# EAGLE design AC_light (EAGLE 8.5.1)
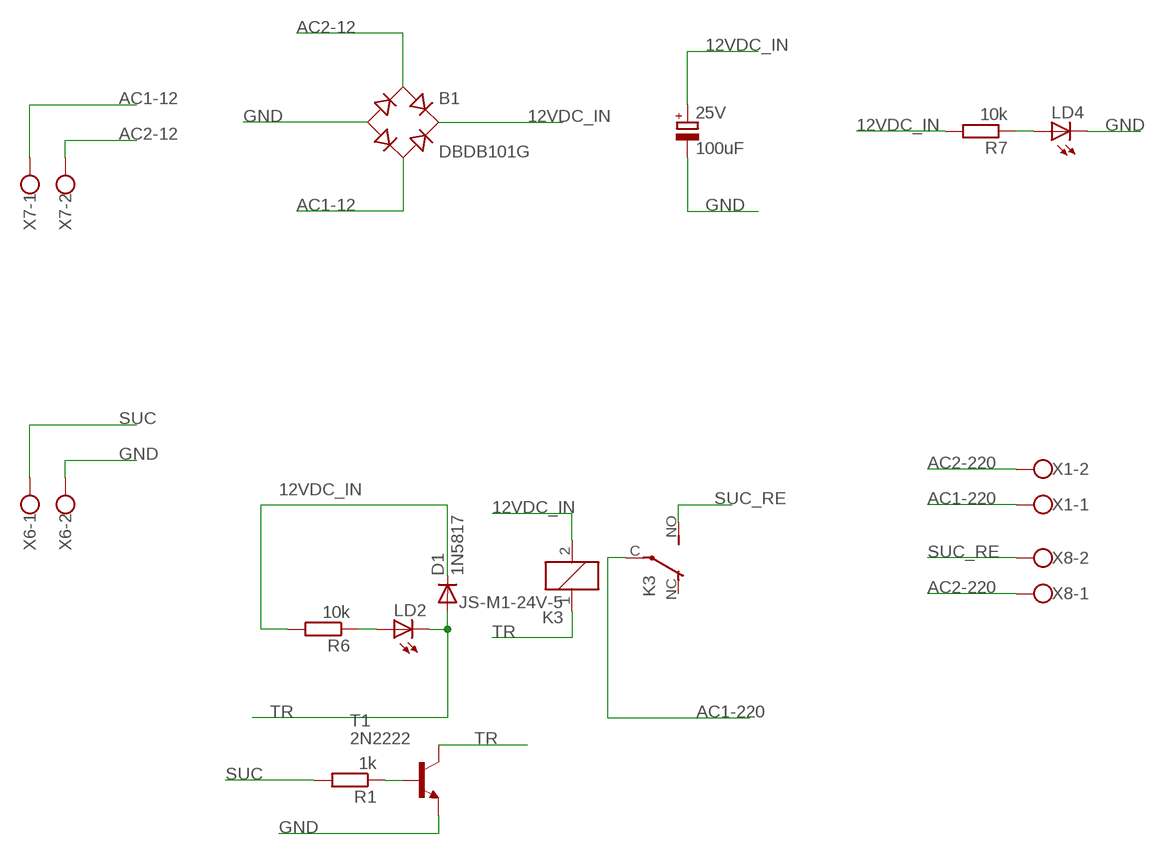
[diagram p0: schematic, sheet 1]

## Parts
25V  100uF  CPOL-EUE3.5-8  [E3,5-8]
B1  DBDB101G  [DB]
D1  1N5817  1N4004  [DO41-10]
K3  JS-M1-24V-5  JS-M1-12V-5  [JS-M]
LD2  LED5MM  [LED5MM]
LD4  LED5MM  [LED5MM]
R1  1k  R-EU_0207/10  [0207/10]
R6  10k  R-EU_0207/10  [0207/10]
R7  10k  R-EU_0207/10  [0207/10]
T1  2N2222  [TO92-EBC-OVAL]
X1  W237-102  [W237-102]
X6  W237-102  [W237-102]
X7  W237-102  [W237-102]
X8  W237-102  [W237-102]

## Nets
12VDC_IN: 25V.+ B1.+ D1.C K3.2 R6.2 R7.2
AC1-12: B1.AC2 X7.1
AC1-220: K3.C(2:P) X1.1
AC2-12: B1.AC1 X7.2
AC2-220: X1.2 X8.1
GND: 25V.- B1.- LD4.K(C) T1.E X6.2
N$3: R1.1 T1.B
N$8: LD4.A R7.1
N$9: LD2.A R6.1
SUC: R1.2 X6.1
SUC_RE: K3.NO(2:S) X8.2
TR: D1.A K3.1 LD2.K(C) T1.C
Unconnected: K3.NC(2:O)

## Library data of the parts
25V = rcl:CPOL-EU: POLARIZED CAPACITOR, European symbol; SPICEPREFIX: C
B1 = rectifier:DB?*G: Single Phase 1.0 AMP Glass Passivated Bridge Rectifier Taiwan Semiconductor Co.,Ltd. - TSC Source: http://www.taiwansemi.com/TSCbig5/ezcatfiles/cust/img/img/db101g.pdf http://www.ts.com.tw/db/pictures/modules/PDT/PDT060207001/DBLS201G.pdf
D1 = adafruit:1N4004: DIODE General purpose 1N400x type rectifier (With bigger pads) http://www.ladyada.net/library/pcb/eaglelibrary.html
K3 = relay:JS-M1*: Automotive Ultra-Miniature Power Relay NAiS Source: http://www.mew-europe.com/.. en_ds_61211_0000.pdf; MF: FARNELL; MPN: JSM1-12V-5; OC_FARNELL: 910351; OC_NEWARK: 14J1764
LD2 LD4 = led:LED: LED OSRAM: - CHIPLED LG R971, LG N971, LY N971, LG Q971, LY Q971, LO R971, LY R971 LH N974, LH R974 LS Q976, LO Q976, LY Q976 LO Q996 - Hyper CHIPLED LW Q18S LB Q993, LB Q99A, LB R99A - SideLED LS A670, LO A670, LY A670, LG A670, LP A670 LB A673, LV A673, LT A673, LW A673 LH A674 LY A675 LS A676, LA A676, LO A676, LY A676, LW A676 LS A679, LY A679, LG A679 - Hyper Micro SIDELED® LS Y876, LA Y876, LO Y876, LY Y876 LT Y87S - SmartLED LW L88C, LW L88S LB L89C, LB L89S, LG L890 LS L89K, LO L89K, LY L89K LS L896, LA L896, LO L896, LY L896 - TOPLED LS T670, LO T670, LY T670, LG T670, LP T670 LSG T670, LSP T670, LSY T670, LOP T670, LYG T670 LG T671, LOG T671, LSG T671 LB T673, LV T673, LT T673, LW T673 LH T674 LS T676, LA T676, LO T676, LY T676, LB T676, LH T676, LSB T676, LW T676 LB T67C, LV T67C, LT T67C, LS T67K, LO T67K, LY T67K, LW E67C LS E67B, LA E67B, LO E67B, LY E67B, LB E67C, LV E67C, LT E67C LW T67C LS T679, LY T679, LG T679 LS T770, LO T770, LY T770, LG T770, LP T770 LB T773, LV T773, LT T773, LW T773 LH T774 LS E675, LA E675, LY E675, LS T675 LS T776, LA T776, LO T776, LY T776, LB T776 LHGB T686 LT T68C, LB T68C - Hyper Mini TOPLED® LB M676 - Mini TOPLED Santana® LG M470 LS M47K, LO M47K, LY M47K Source: http://www.osram.convergy.de/
R1 R6 R7 = rcl-2:R-EU_: RESISTOR, European symbol
T1 = adafruit:2N2222: NPN TRANSISTOR Big oval pads
X1 X6-X8 = con-wago-500:W237-102: WAGO SCREW CLAMP

## Board
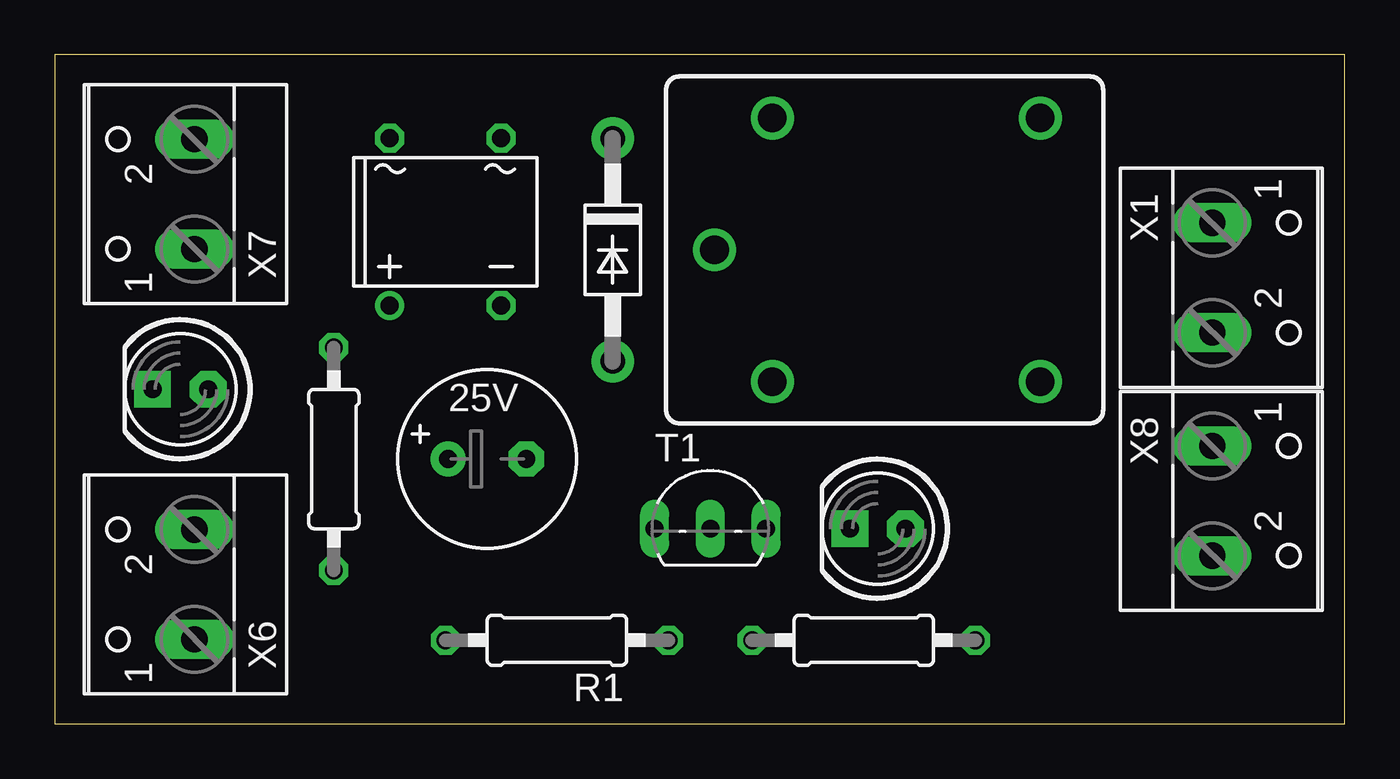
[diagram p1: board, top side]
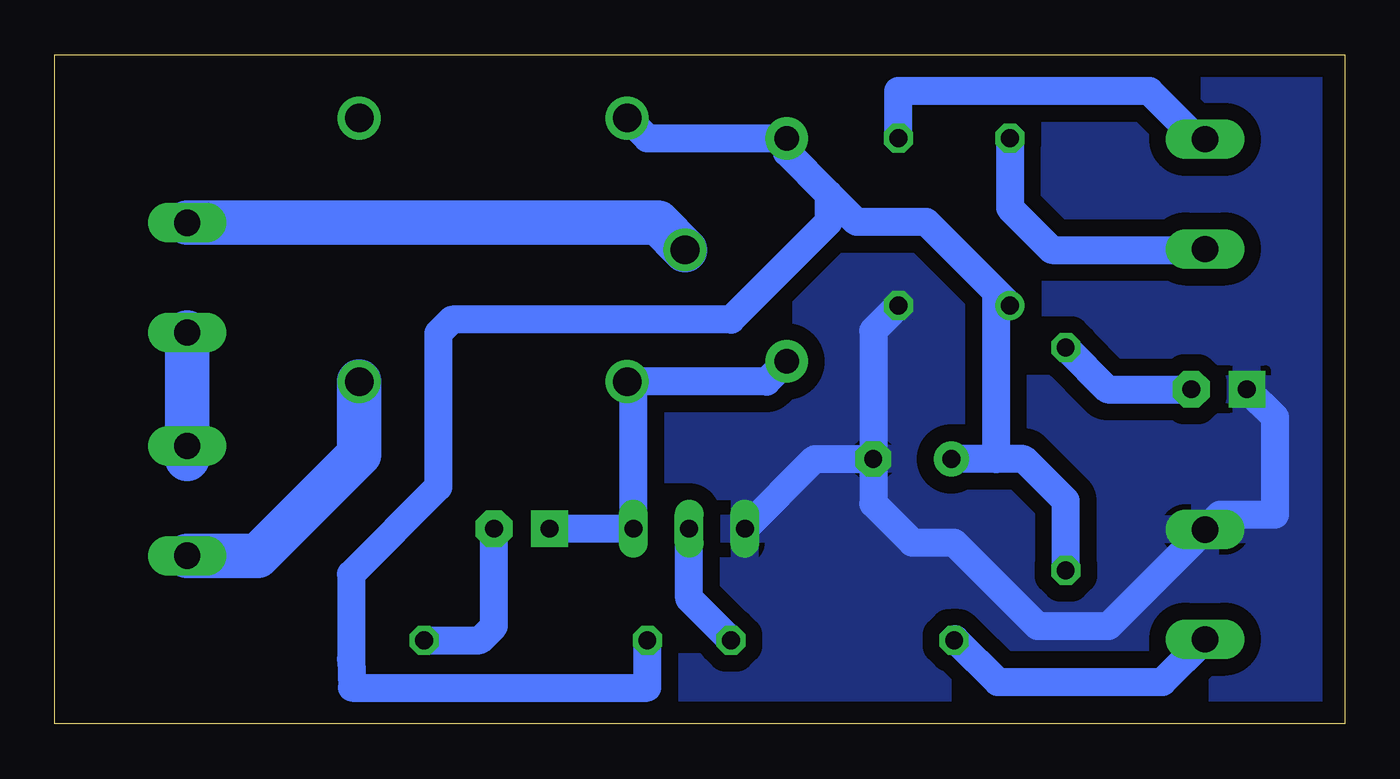
[diagram p2: board, bottom side, seen from below]

Size 58.73 x 30.47 mm. Coordinates in mm from the lower left corner, seen from the top.
Outline: 0,0 58.73,0 58.73,30.47 0,30.47 0,0
Copper layers (1*16): Top 0.035mm / dielectric 1.5mm / Bottom 0.035mm
Design rules "default *": minimum track width 30mil, minimum drill 0.35mm, track to track 30mil, track to pad 30mil, pad to pad 6mil, via to via 6mil, smd to smd 6mil, copper to edge 40mil, drill to drill 6mil, minimum pad ring 10mil, minimum via ring 8mil, stop-mask expansion 4mil, vias tented up to drill 0mil, thermal gap 10mil

### Footprints (pad centres in the part's own frame; a part is rotated, then mirrored left to right if it is on the bottom)
E3,5-8 = drill 0.813 pad 1.6: + -1.778,0 | drill 0.813 pad 1.6 octagon: - 1.778,0
DB = drill 0.813: + -2.54,-3.81 | drill 0.813 octagon: - 2.54,-3.81; AC1 2.54,3.81; AC2 -2.54,3.81
DO41-10 = drill 1.118 pad 1.93: A 5.08,0; C -5.08,0
JS-M = drill 1.3: 1 6.7,6; 2 6.7,-6; C 9.335,0; NC -5.5,-6; NO -5.5,6
LED5MM = drill 0.813 pad 1.676 octagon: A -1.27,0 | drill 0.813 pad 1.676 square: K 1.27,0
0207/10 = drill 0.813 octagon: 1 -5.08,0; 2 5.08,0
TO92-EBC-OVAL = drill 0.813 long: B 0,-1.27; C 2.54,-1.27; E -2.54,-1.27
W237-102 = drill 1.194 long: 1 -2.5,-1.27; 2 2.5,-1.27

### Placement (x,y rotation side)
25V  19.68,12.06 0 top
B1  17.78,22.86 0 top
D1  25.4,21.59 270 top
K3  39.37,21.59 180 top
LD2  37.47,8.89 180 top
LD4  5.71,15.24 180 top
R1  22.86,3.81 180 top
R6  36.83,3.81 180 top
R7  12.7,12.06 270 top
T1  29.84,10.16 0 top
X1  53.98,20.32 270 top
X6  5.08,6.35 90 top
X7  5.08,24.13 90 top
X8  53.98,10.16 270 top

### Tracks (layer width: path | path; a pad name or v marks a point on that pad's centre or on a via)
12VDC_IN
  Bottom 1.27: K3.2 31.75,26.67 D1.C 25.4,26.04 23.5,24.13 | 23.5,24.13 22.23,22.86 19.05,22.86 15.88,19.68 | B1.+ 15.88,19.68 | R7.2 12.7,10.16 14.61,12.06 15.88,12.06 | 15.88,12.06 25V.+ | 15.88,19.68 15.88,12.06 | 23.5,24.13 23.5,22.86 27.94,18.41 40.64,18.41 41.27,17.78 41.27,10.78 45.24,6.82 45.24,2.96 45.2,1.65 31.75,1.65 R6.2
AC1-12
  Bottom 1.27: 15.24,26.04 B1.AC2 15.24,23.5 13.34,21.59 6.39,21.59 X7.1
AC1-220
  Bottom 2.032: X1.1 31.27,22.82 K3.C
AC2-12
  Bottom 1.27: B1.AC1 20.32,28.82 8.89,28.82 6.74,26.67 6.31,26.67 | X7.2 6.31,26.67 | 6.31,26.67 5.71,26.67
AC2-220
  Bottom 1.27: X1.2 X8.1
  Bottom 2.032: X1.2 52.7,12.06
GND
  Bottom 1.27: T1.E 24.13,12.06 25V.- | B1.- 21.46,17.91 25V.- | LD4.K 3.17,13.97 3.17,9.53 5.67,9.53 X6.2 10.76,4.45 13.97,4.45 17.78,8.26 19.68,8.26 21.46,10.03 25V.-
  pour Bottom: 0,30.48 57.78,30.48 58.42,29.84 58.42,0 0.64,0 0,0.64 0,29.84
N$3
  Bottom 1.27: R1.1 29.84,5.71 T1.B
N$8
  Bottom 1.27: R7.1 10.79,15.24 LD4.A
N$9
  Bottom 1.27: LD2.A 38.73,4.45 39.37,3.81 R6.1
SUC
  Bottom 1.27: R1.2 17.74,3.85 15.79,1.91 8.29,1.91 X6.1
SUC_RE
  Bottom 2.032: X8.2 49.49,7.66 44.87,12.28 K3.NO
TR
  Bottom 1.27: D1.A 26.32,15.59 K3.1 32.38,15.3 T1.C LD2.K